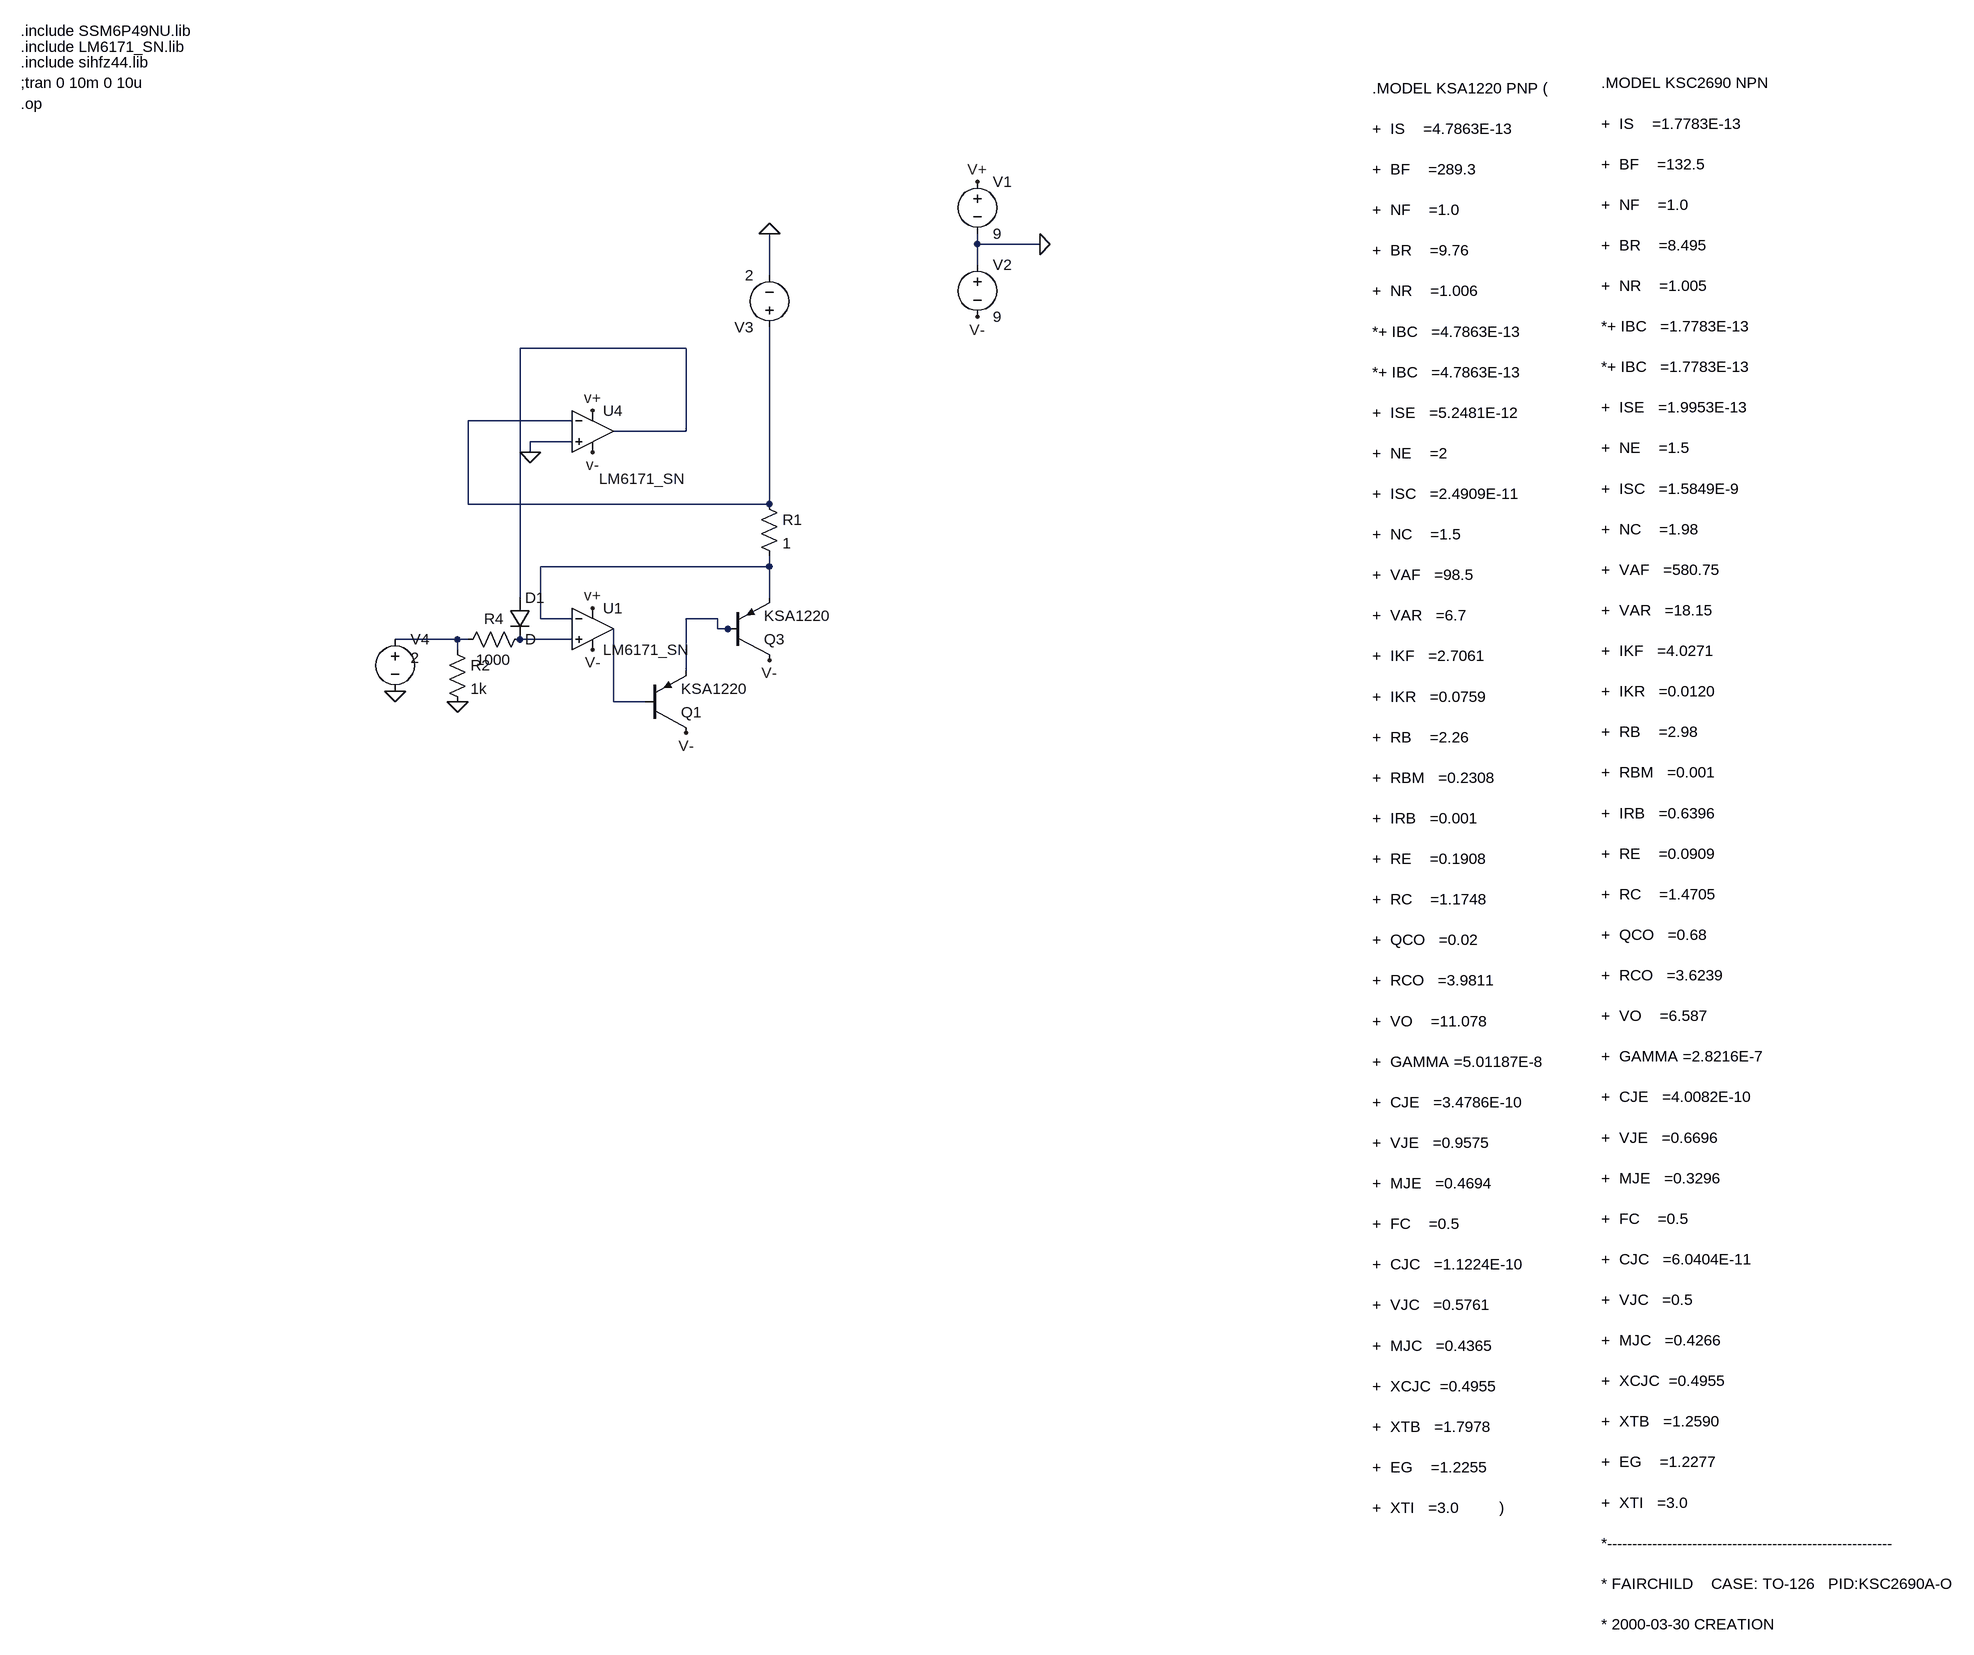
[diagram p0: schematic DC-DC_load_rev_2.asc]
DC-DC_load_rev_2.asc, the LTspice schematic file:
Version 4
SHEET 1 2640 680
WIRE 1056 -160 1056 -176
WIRE 1152 -160 1056 -160
WIRE 1056 -128 1056 -160
WIRE 736 -112 736 -176
WIRE 608 0 352 0
WIRE 432 112 272 112
WIRE 608 128 608 0
WIRE 608 128 496 128
WIRE 432 144 368 144
WIRE 368 160 368 144
WIRE 272 240 272 112
WIRE 736 240 736 -32
WIRE 736 240 272 240
WIRE 736 336 736 320
WIRE 736 336 384 336
WIRE 352 384 352 0
WIRE 736 384 736 336
WIRE 384 416 384 336
WIRE 432 416 384 416
WIRE 656 416 608 416
WIRE 656 432 656 416
WIRE 672 432 656 432
WIRE 688 432 672 432
WIRE 256 448 160 448
WIRE 272 448 256 448
WIRE 432 448 352 448
WIRE 256 464 256 448
WIRE 608 496 608 416
WIRE 496 544 496 432
WIRE 544 544 496 544
FLAG 464 96 v+
FLAG 464 160 v-
FLAG 1152 -160 0
FLAG 1056 -256 V+
FLAG 1056 -48 V-
FLAG 368 160 0
FLAG 736 480 V-
FLAG 464 464 V-
FLAG 464 400 v+
FLAG 736 -176 0
FLAG 160 528 0
FLAG 256 544 0
FLAG 608 592 V-
SYMBOL Opamps\\opamp2 464 368 R0
SYMATTR InstName U1
SYMATTR Value LM6171_SN
SYMBOL Opamps\\opamp2 464 64 R0
WINDOW 3 10 137 Left 2
SYMATTR Value LM6171_SN
SYMATTR InstName U4
SYMBOL voltage 1056 -272 R0
WINDOW 123 0 0 Left 2
WINDOW 39 0 0 Left 2
SYMATTR InstName V1
SYMATTR Value 9
SYMBOL voltage 1056 -144 R0
WINDOW 123 0 0 Left 2
WINDOW 39 0 0 Left 2
SYMATTR InstName V2
SYMATTR Value 9
SYMBOL pnp 672 480 M180
SYMATTR InstName Q3
SYMATTR Value KSA1220
SYMBOL res 720 224 R0
SYMATTR InstName R1
SYMATTR Value 1
SYMBOL voltage 736 -16 R180
WINDOW 123 0 0 Left 2
WINDOW 39 -118 -3 Left 2
SYMATTR InstName V3
SYMATTR Value 2
SYMBOL voltage 160 432 R0
WINDOW 3 24 44 Left 2
WINDOW 123 0 0 Left 2
WINDOW 39 0 0 Left 2
SYMATTR Value 2
SYMATTR InstName V4
SYMBOL res 240 448 R0
SYMATTR InstName R2
SYMATTR Value 1k
SYMBOL res 368 432 R90
WINDOW 0 0 56 VBottom 2
WINDOW 3 32 56 VTop 2
SYMATTR InstName R4
SYMATTR Value 1000
SYMBOL diode 336 384 R0
SYMATTR InstName D1
SYMBOL pnp 544 592 M180
SYMATTR InstName Q1
SYMATTR Value KSA1220
TEXT -416 -376 Left 2 !.op
TEXT -416 -464 Left 2 !.include LM6171_SN.lib
TEXT -416 -408 Left 2 !;tran 0 10m 0 10u
TEXT -416 -440 Left 2 !.include sihfz44.lib
TEXT -416 -488 Left 2 !.include SSM6P49NU.lib
TEXT 1664 -400 Left 2 !.MODEL KSA1220 PNP ( \n\n+  IS    =4.7863E-13      \n\n+  BF    =289.3\n\n+  NF    =1.0 \n\n+  BR    =9.76\n\n+  NR    =1.006\n\n*+ IBC   =4.7863E-13\n\n*+ IBC   =4.7863E-13\n\n+  ISE   =5.2481E-12\n\n+  NE    =2\n\n+  ISC   =2.4909E-11\n\n+  NC    =1.5\n\n+  VAF   =98.5\n\n+  VAR   =6.7\n\n+  IKF   =2.7061\n\n+  IKR   =0.0759\n\n+  RB    =2.26\n\n+  RBM   =0.2308\n\n+  IRB   =0.001\n\n+  RE    =0.1908\n\n+  RC    =1.1748\n\n+  QCO   =0.02\n\n+  RCO   =3.9811\n\n+  VO    =11.078\n\n+  GAMMA =5.01187E-8\n\n+  CJE   =3.4786E-10\n\n+  VJE   =0.9575\n\n+  MJE   =0.4694\n\n+  FC    =0.5\n\n+  CJC   =1.1224E-10\n\n+  VJC   =0.5761\n\n+  MJC   =0.4365\n\n+  XCJC  =0.4955   \n\n+  XTB   =1.7978    \n\n+  EG    =1.2255 \n\n+  XTI   =3.0         )
TEXT 2016 -408 Left 2 !.MODEL KSC2690 NPN\n\n+  IS    =1.7783E-13      \n\n+  BF    =132.5\n\n+  NF    =1.0 \n\n+  BR    =8.495\n\n+  NR    =1.005\n\n*+ IBC   =1.7783E-13 \n\n*+ IBC   =1.7783E-13 \n\n+  ISE   =1.9953E-13\n\n+  NE    =1.5\n\n+  ISC   =1.5849E-9\n\n+  NC    =1.98\n\n+  VAF   =580.75\n\n+  VAR   =18.15\n\n+  IKF   =4.0271\n\n+  IKR   =0.0120\n\n+  RB    =2.98\n\n+  RBM   =0.001\n\n+  IRB   =0.6396\n\n+  RE    =0.0909\n\n+  RC    =1.4705\n\n+  QCO   =0.68\n\n+  RCO   =3.6239\n\n+  VO    =6.587\n\n+  GAMMA =2.8216E-7\n\n+  CJE   =4.0082E-10\n\n+  VJE   =0.6696\n\n+  MJE   =0.3296\n\n+  FC    =0.5\n\n+  CJC   =6.0404E-11\n\n+  VJC   =0.5\n\n+  MJC   =0.4266\n\n+  XCJC  =0.4955   \n\n+  XTB   =1.2590    \n\n+  EG    =1.2277 \n\n+  XTI   =3.0         \n\n*---------------------------------------------------------\n\n* FAIRCHILD    CASE: TO-126   PID:KSC2690A-O\n\n* 2000-03-30 CREATION

The netlist it stands for:
* DC-DC_load_rev_2.asc
XU1 N006 N003 v+ v- N007 LM6171_SN  ; pins In+ In- V+ V- OUT
XU4 0 N002 v+ v- N001 LM6171_SN  ; pins In+ In- V+ V- OUT
V1 v+ 0 9
V2 0 v- 9
Q3 v- N004 N003 0 KSA1220
R1 N002 N003 1
V3 N002 0 2
V4 N005 0 2
R2 N005 0 1k
R4 N006 N005 1000
D1 N001 N006 D
Q1 v- N007 N004 0 KSA1220
.model D D
.lib standard.dio
.model NPN NPN
.model PNP PNP
.lib standard.bjt
.op
.include LM6171_SN.lib
;tran 0 10m 0 10u
.include sihfz44.lib
.include SSM6P49NU.lib
.MODEL KSA1220 PNP (
+  IS    =4.7863E-13
+  BF    =289.3
+  NF    =1.0
+  BR    =9.76
+  NR    =1.006
*+ IBC   =4.7863E-13
*+ IBC   =4.7863E-13
+  ISE   =5.2481E-12
+  NE    =2
+  ISC   =2.4909E-11
+  NC    =1.5
+  VAF   =98.5
+  VAR   =6.7
+  IKF   =2.7061
+  IKR   =0.0759
+  RB    =2.26
+  RBM   =0.2308
+  IRB   =0.001
+  RE    =0.1908
+  RC    =1.1748
+  QCO   =0.02
+  RCO   =3.9811
+  VO    =11.078
+  GAMMA =5.01187E-8
+  CJE   =3.4786E-10
+  VJE   =0.9575
+  MJE   =0.4694
+  FC    =0.5
+  CJC   =1.1224E-10
+  VJC   =0.5761
+  MJC   =0.4365
+  XCJC  =0.4955
+  XTB   =1.7978
+  EG    =1.2255
+  XTI   =3.0         )
.MODEL KSC2690 NPN
+  IS    =1.7783E-13
+  BF    =132.5
+  NF    =1.0
+  BR    =8.495
+  NR    =1.005
*+ IBC   =1.7783E-13
*+ IBC   =1.7783E-13
+  ISE   =1.9953E-13
+  NE    =1.5
+  ISC   =1.5849E-9
+  NC    =1.98
+  VAF   =580.75
+  VAR   =18.15
+  IKF   =4.0271
+  IKR   =0.0120
+  RB    =2.98
+  RBM   =0.001
+  IRB   =0.6396
+  RE    =0.0909
+  RC    =1.4705
+  QCO   =0.68
+  RCO   =3.6239
+  VO    =6.587
+  GAMMA =2.8216E-7
+  CJE   =4.0082E-10
+  VJE   =0.6696
+  MJE   =0.3296
+  FC    =0.5
+  CJC   =6.0404E-11
+  VJC   =0.5
+  MJC   =0.4266
+  XCJC  =0.4955
+  XTB   =1.2590
+  EG    =1.2277
+  XTI   =3.0
*---------------------------------------------------------
* FAIRCHILD    CASE: TO-126   PID:KSC2690A-O
* 2000-03-30 CREATION
.backanno
.end